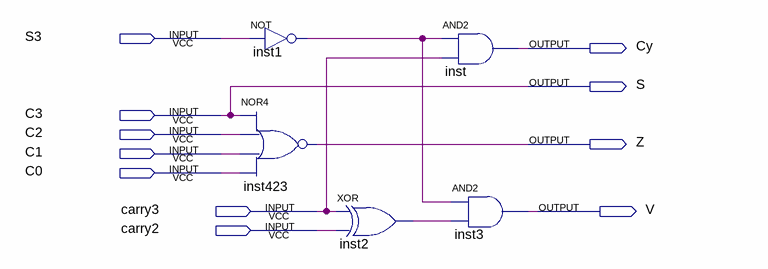
[diagram p0: schematic sheet]
// Quartus schematic state4bits.bdf as structural Verilog: 5 symbols, 11 pins
module state4bits (
  input  S3,
  input  C3,
  input  C2,
  input  C1,
  input  C0,
  input  carry3,
  input  carry2,
  output Cy,
  output S,
  output Z,
  output V
);

  wire inst1_out, inst2_out;

  not inst1 (inst1_out, S3);
  nor inst423 (Z, C3, C2, C1, C0);
  xor inst2 (inst2_out, carry3, carry2);
  and inst (Cy, inst1_out, carry3);
  and inst3 (V, inst1_out, inst2_out);

  assign S = C3;
endmodule
